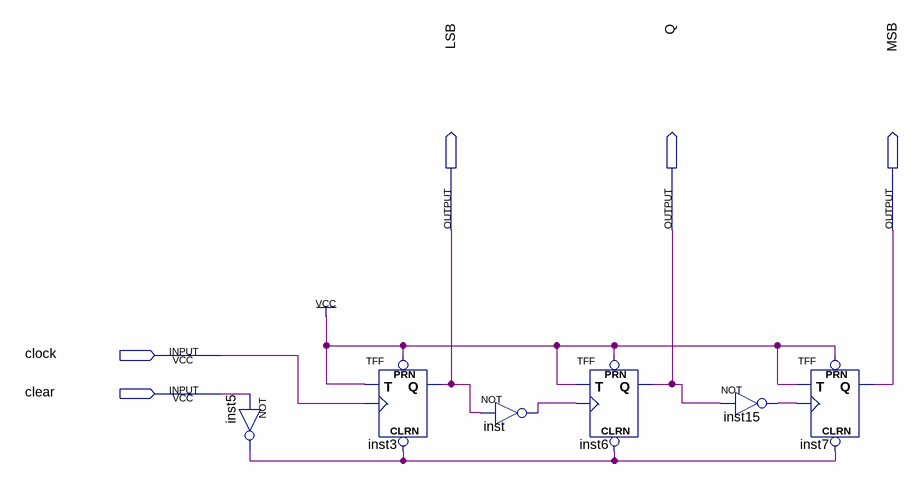
[diagram p0: schematic sheet]
// Quartus schematic contador_assincrono_box.bdf as structural Verilog: 6 symbols, 5 pins
module contador_assincrono_box (
  input  clock,
  input  clear,
  output LSB,
  output Q,
  output MSB
);

  wire inst5_out, inst15_out, inst_out;

  not inst5 (inst5_out, clear);
  TFF inst3 (.PRN(1'b1), .CLRN(inst5_out), .T(1'b1), .CLK(clock), .Q(LSB));
  not inst (inst_out, LSB);
  TFF inst6 (.PRN(1'b1), .CLRN(inst5_out), .T(1'b1), .CLK(inst_out), .Q(Q));
  not inst15 (inst15_out, Q);
  TFF inst7 (.PRN(1'b1), .CLRN(inst5_out), .T(1'b1), .CLK(inst15_out), .Q(MSB));
endmodule
